# EAGLE design Master (EAGLE 9.6.2)
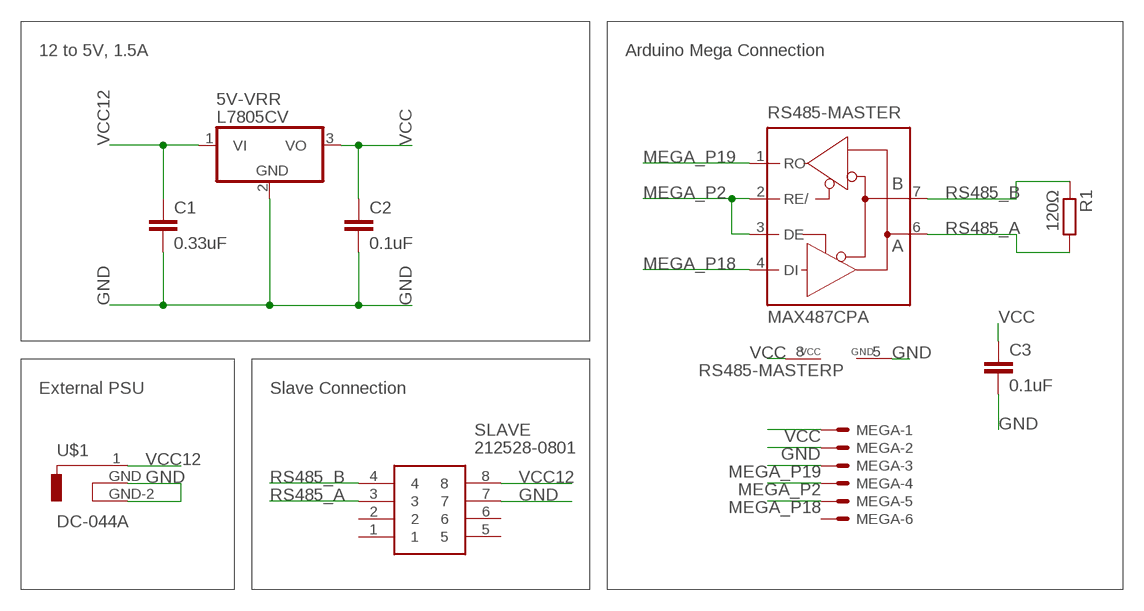
[diagram p0: schematic, sheet 1]

## Parts
5V-VRR  L7805CV  7805T  [TO220H]
C1  0.33uF  C-EU025-025X050  [C025-025X050]
C2  0.1uF  C-EU025-025X050  [C025-025X050]
C3  0.1uF  C-EU025-025X050  [C025-025X050]
MEGA  22-23-2061  [22-23-2061]
R1  120Ω  R-EU_0207/10  [0207/10]
RS485-MASTER  MAX487CPA  [DIL08]
SLAVE  212528-0801  [212528-08YY]
U$1  DC-044A  [DC-044A]

## Nets
GND: 5V-VRR.2(GND) C1.2 C2.2 C3.2 MEGA.2 RS485-MASTER.5(GND) SLAVE.7 U$1.GND U$1.GND-2
MEGA_P2: MEGA.4 RS485-MASTER.2(RE/) RS485-MASTER.3(DE)
MEGA_P18: MEGA.5 RS485-MASTER.4(DI)
MEGA_P19: MEGA.3 RS485-MASTER.1(RO)
RS485_A: R1.2 RS485-MASTER.6(A) SLAVE.3
RS485_B: R1.1 RS485-MASTER.7(B) SLAVE.4
VCC: 5V-VRR.3(VO) C2.1 C3.1 MEGA.1 RS485-MASTER.8(VCC)
VCC12: 5V-VRR.1(VI) C1.1 SLAVE.8 U$1.1
Unconnected: MEGA.6 SLAVE.1 SLAVE.2 SLAVE.5 SLAVE.6

## Notes on the sheet
- 12 to 5V, 1.5A | Arduino Mega Connection
- External PSU | Slave Connection

## Library data of the parts
5V-VRR = linear:78*: Positive VOLTAGE REGULATOR Source: http://cache.national.com/ds/LM/LM78L05.pdf http://www.fairchildsemi.com/ds/LM/LM7805.pdf
C1-C3 = rcl:C-EU: CAPACITOR, European symbol; SPICEPREFIX: C
MEGA = con-molex:22-23-2061: .100" (2.54mm) Center Header - 6 Pin; MF: MOLEX; MPN: 22-23-2061; OC_FARNELL: 1462922; OC_NEWARK: 27C1933
R1 = rcl:R-EU_: RESISTOR, European symbol; SPICEPREFIX: R
RS485-MASTER = A10 Library:MAX487CPA: RS485 TRANSEIVER; MPN: MAX487CPA; OC_FARNELL: unknown; OC_NEWARK: unknown
SLAVE = SamacSys_Parts:212528-0801: Micro-Fit+ Right-Angle Header, 3.00mm Pitch, Dual Row, 8 Circuits, UL 94V-0, Glow-Wire Capable, Black Source: Datasheet <https://www.molex.com/pdm_docs/sd/2125280200_sd.pdf>; DESCRIPTION: Micro-Fit+ Right-Angle Header, 3.00mm Pitch, Dual Row, 8 Circuits, UL 94V-0, Glow-Wire Capable, Black; HEIGHT: 14mm; MANUFACTURER_NAME: Molex; MANUFACTURER_PART_NUMBER: 212528-0801; MOUSER_PART_NUMBER: 538-212528-0801; MOUSER_PRICE-STOCK: https://www.mouser.co.uk/ProductDetail/Molex/212528-0801?qs=W%2FMpXkg%252BdQ6GImXrcV4pVA%3D%3D
U$1 = A10 Library:DC-044A

## Net classes
0 default: width 0.406 mm, drill 0.254 mm, clearance 0.406 mm
1 5A: width 2.794 mm, drill 0.254 mm, clearance 0.152 mm

## Board
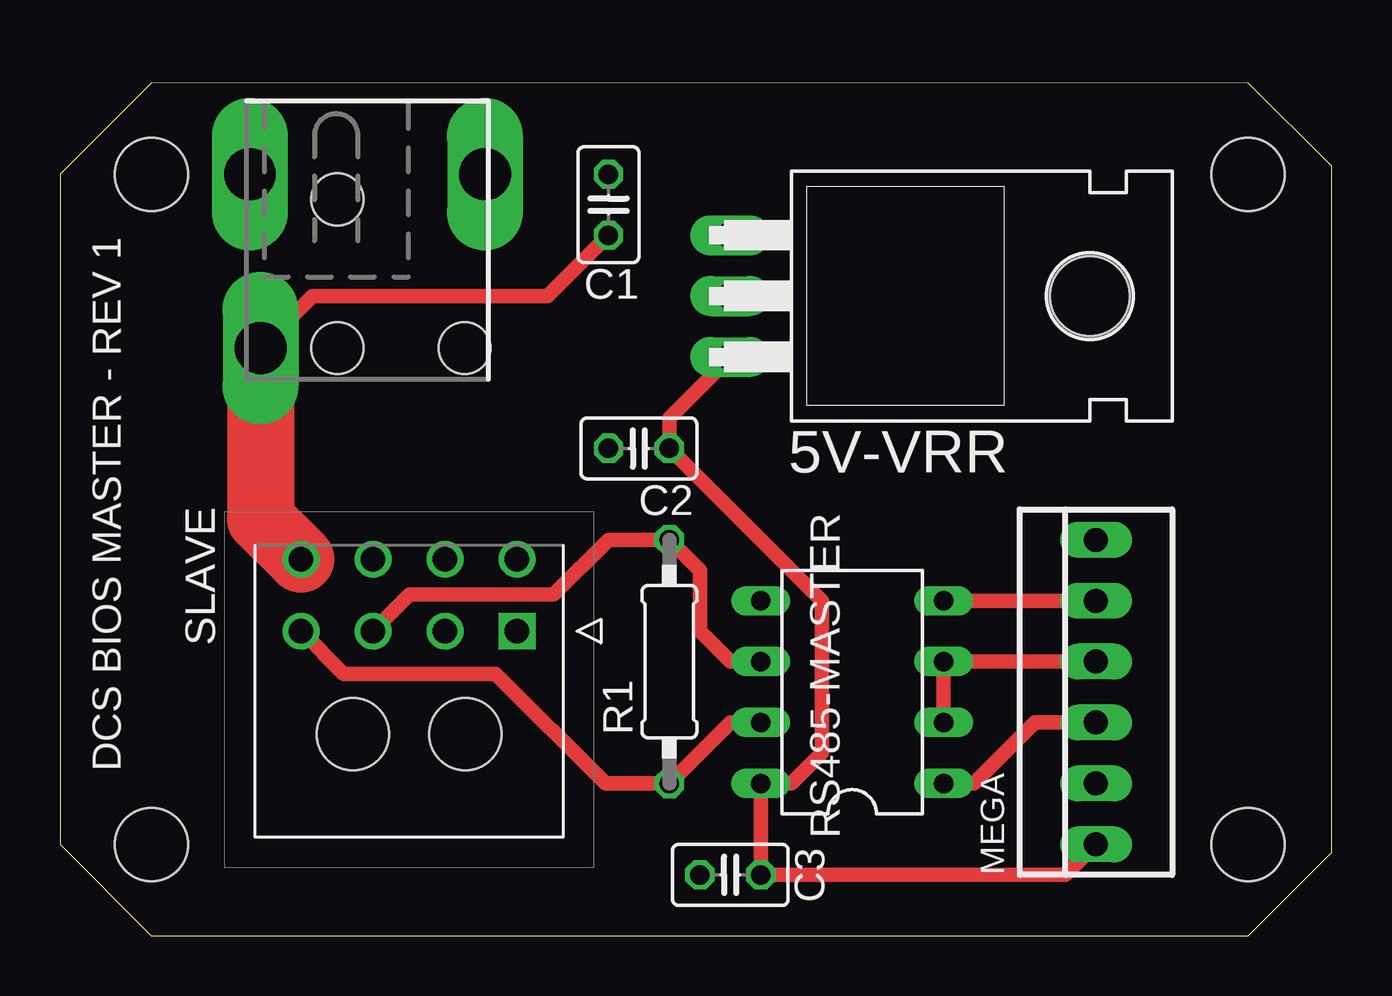
[diagram p1: board, top side]
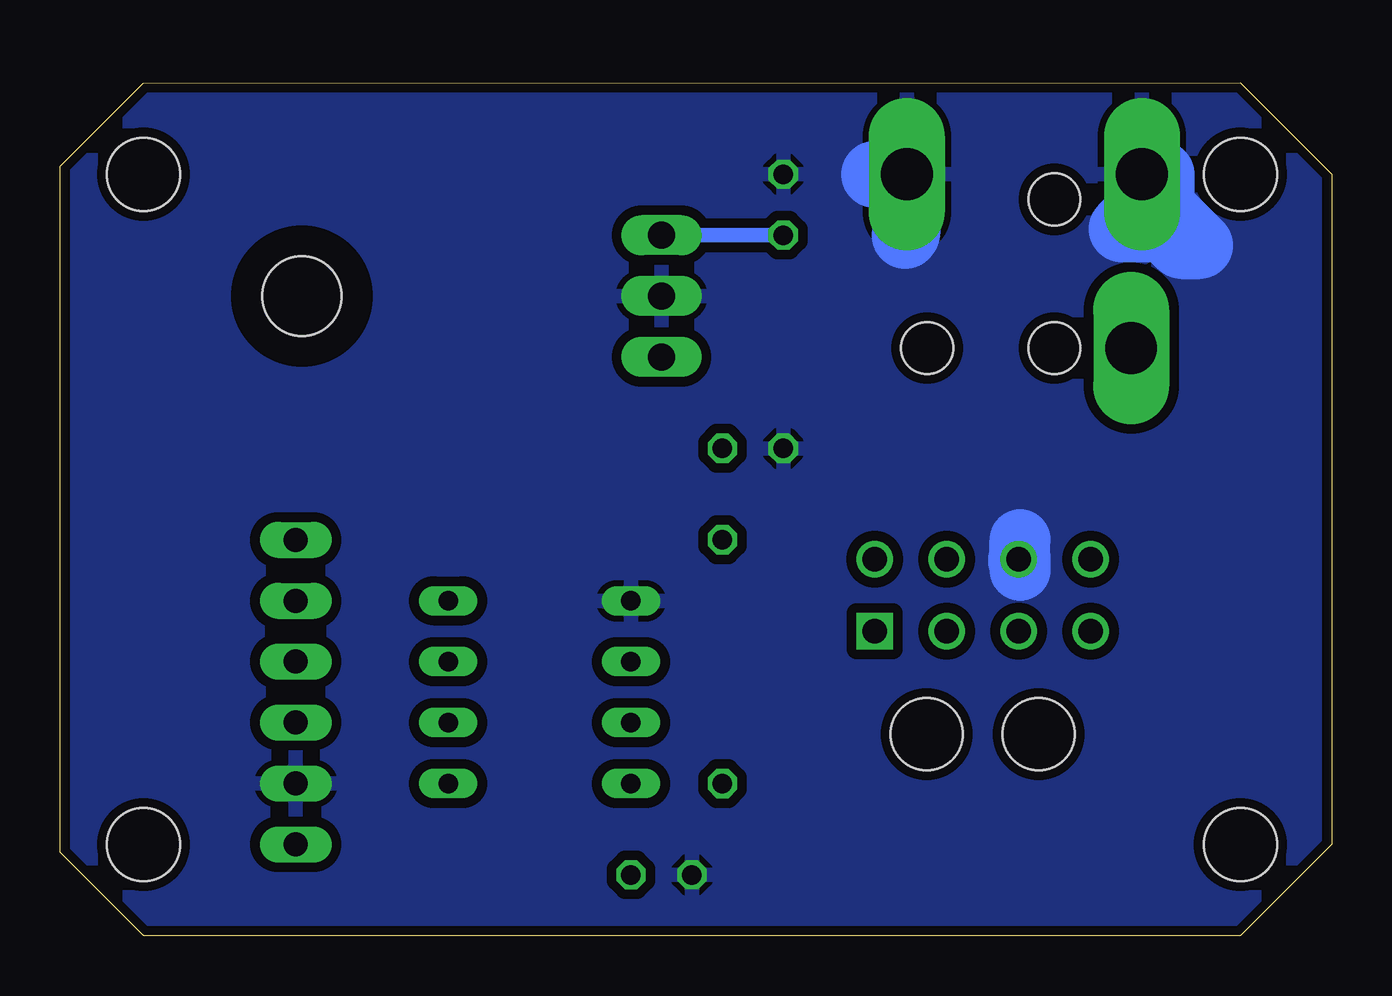
[diagram p2: board, bottom side, seen from below]

Size 53.01 x 35.57 mm. Coordinates in mm from the lower left corner, seen from the top.
Outline: 49.54,35.55 3.82,35.57 0,31.75 0,3.81 3.81,0 49.53,0 53.01,3.48 53.01,32.08 49.54,35.55
Copper layers (1*16): Top 0.035559375mm / dielectric 1.6mm / Bottom 0.035559375mm
Design rules "oshpark-2layer": minimum track width 6mil, minimum drill 10mil, track to track 6mil, track to pad 6mil, pad to pad 6mil, via to via 6mil, smd to smd 6mil, copper to edge 15mil, drill to drill 6mil, minimum pad ring 5mil, minimum via ring 5mil, stop-mask expansion 2.5mil, vias tented up to drill 0mil, thermal gap 10mil
Holes 3.05 mm at 3.81,3.81 3.81,31.75 49.53,31.75 49.53,3.81

### Footprints (pad centres in the part's own frame; a part is rotated, then mirrored left to right if it is on the bottom)
TO220H = drill 1.118 long: 1 -2.54,-10.16; 2 0,-10.16; 3 2.54,-10.16 | hole 3.302: 0,4.826
C025-025X050 = drill 0.813 octagon: 1 -1.27,0; 2 1.27,0
22-23-2061 = drill 1 long: 1 -6.35,0; 2 -3.81,0; 3 -1.27,0; 4 1.27,0; 5 3.81,0; 6 6.35,0
0207/10 = drill 0.813 octagon: 1 -5.08,0; 2 5.08,0
DIL08 = drill 0.813 long: 1 -3.81,-3.81; 2 -1.27,-3.81; 3 1.27,-3.81; 4 3.81,-3.81; 5 3.81,3.81; 6 1.27,3.81; 7 -1.27,3.81; 8 -3.81,3.81
212528-08YY = drill 1.02 pad 1.52 square: 1 0,0 | drill 1.02 pad 1.52: 2 -3,0; 3 -6,0; 4 -9,0; 5 0,3; 6 -3,3; 7 -6,3; 8 -9,3 | hole 3: -2.16,-4.3; -6.84,-4.3
DC-044A = drill 2.159 pad 2.794 long: 1 4.42,3.78; GND 4.87,-3.47; GND-2 -4.93,-3.47 | hole 2.159: 1.22,-2.42; -4.08,3.78; 1.22,3.78

### Placement (x,y rotation side)
5V-VRR  38.1,26.67 270 top
C1  22.86,30.48 90 top
C2  24.13,20.32 180 top
C3  27.94,2.54 180 top
MEGA  43.18,10.16 90 top
R1  25.4,11.43 90 top
RS485-MASTER  33.02,10.16 90 top
SLAVE  19.05,12.7 0 top
U$1  12.78,28.28 180 top

### Tracks (layer width: path | path; a pad name or v marks a point on that pad's centre or on a via)
GND
  Bottom 2.54: 13,16.51 13,15.75 SLAVE.7 13.05,15.59 13,15.54 13,15.24
  Bottom 2.794: 19.05,31.75 U$1.GND-2 17.71,29.28 17.78,29.21 | U$1.GND 7.91,30.31 8.74,29.48 6.96,29.48 6.26,28.78 5.51,28.78 7.11,30.38 7.11,31.75
  pour Bottom (isolate 0.406): -1.27,36.83 54.61,36.83 54.61,-1.27 -1.27,-1.27
MEGA_P2
  Top 0.61: MEGA.4 RS485-MASTER.3 RS485-MASTER.2
MEGA_P18
  Top 0.61: MEGA.5 RS485-MASTER.4
MEGA_P19
  Top 0.61: MEGA.3 40.64,8.89 38.1,6.35 RS485-MASTER.1
RS485_A
  Top 0.61: SLAVE.3 14.57,14.22 20.57,14.22 22.86,16.51 R1.2 26.67,15.24 26.67,12.7 27.94,11.43 RS485-MASTER.6
RS485_B
  Top 0.61: SLAVE.4 11.83,10.92 18.16,10.92 22.73,6.35 R1.1 26.67,7.62 27.94,8.89 RS485-MASTER.7
VCC
  Top 0.61: 5V-VRR.3 25.4,21.59 C2.1 31.75,13.97 31.75,7.62 30.48,6.35 RS485-MASTER.8 C3.1 41.91,2.54 MEGA.1
VCC12
  Top 0.61: U$1.1 10.53,26.67 20.32,26.67 C1.1
  Top 2.794: U$1.1 8.36,17.39 SLAVE.8
  Bottom 0.61: 5V-VRR.1 C1.1

### Text on the board
tNames: DCS BIOS MASTER - REV 1